# Altium schematic sheet Top.SchDoc
size A4
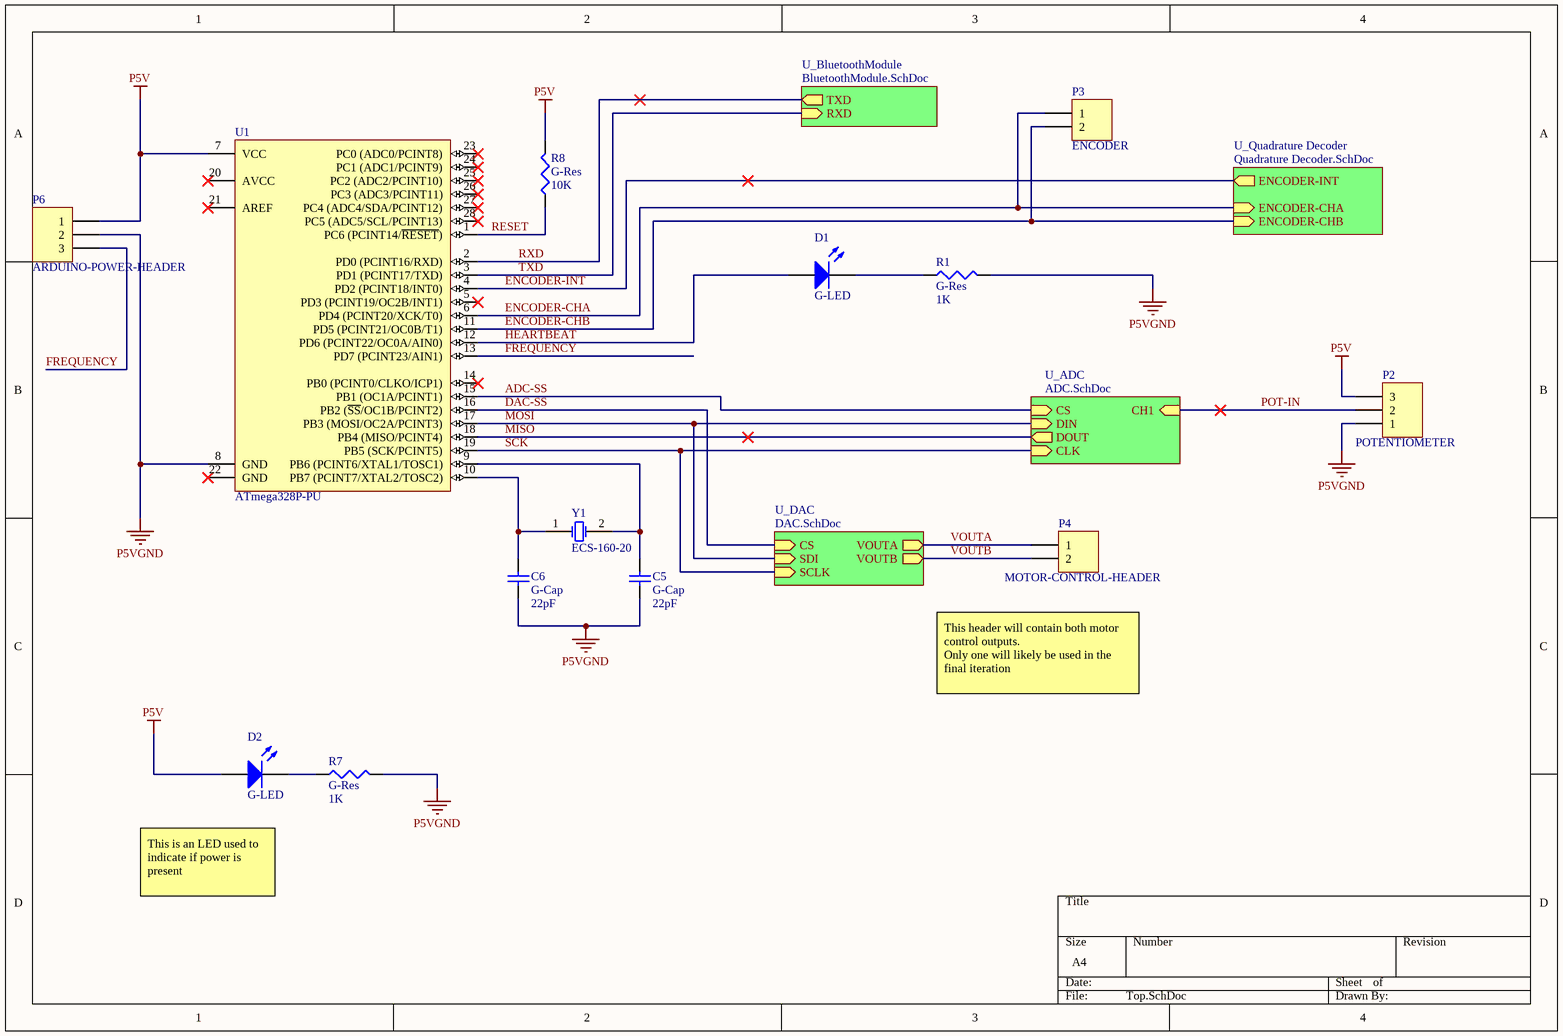
[diagram p0: Top.SchDoc]

## Parts
C5  G-Cap  value 22pF  [Cap2.54mm_LGE1.0]
C6  G-Cap  value 22pF  [Cap2.54mm_LGE1.0]
D1  G-LED  [LED_LGE1.0]
D2  G-LED  [LED_LGE1.0]
P2  POTENTIOMETER  [HDR1X3_LGE1.0]
P3  ENCODER  [HDR1X2_LGE1.0]
P4  MOTOR-CONTROL-HEADER  [HDR1X2_LGE1.0]
P6  ARDUINO-POWER-HEADER  [HDR1X3_LGE1.0]
R1  G-Res  value 1K  [Res2.54mm_LGE1.0]
R7  G-Res  value 1K  [Res2.54mm_LGE1.0]
R8  G-Res  value 10K  [Res2.54mm_LGE1.0]
U1  ATmega328P-PU  [ISDIP16_LGE1.0]
Y1  ECS-160-20  [HC-49U]

## Sub-sheets
U_ADC = ADC.SchDoc: CLK (in), DOUT (out), DIN (in), CS (in), CH1 (in)
U_BluetoothModule = BluetoothModule.SchDoc: TXD (out), RXD (in)
U_DAC = DAC.SchDoc: VOUTA (out), VOUTB (out), CS (in), SCLK (in), SDI (in)
U_Quadrature Decoder = Quadrature Decoder.SchDoc: ENCODER-CHA (in), ENCODER-CHB (in), ENCODER-INT (out)

## Nets
P5V: D2.1(A) P2.3 P6.1 R8.2 U1.7(VCC)
P5VGND: C5.1 C6.1 P2.1 P6.2 R1.2 R7.2 U1.8(GND)
ADC-SS: U1.15(PB1_(OC1A/PCINT1)) ; sheet U_ADC/CS
DAC-SS: U1.16(PB2_(~{SS}/OC1B/PCINT2)) ; sheet U_DAC/CS
ENCODER-CHA: P3.1 U1.6(PD4_(PCINT20/XCK/T0)) ; sheet U_Quadrature Decoder/ENCODER-CHA
ENCODER-CHB: P3.2 U1.11(PD5_(PCINT21/OC0B/T1)) ; sheet U_Quadrature Decoder/ENCODER-CHB
ENCODER-INT: U1.4(PD2_(PCINT18/INT0)) ; sheet U_Quadrature Decoder/ENCODER-INT
FREQUENCY: P6.3 U1.13(PD7_(PCINT23/AIN1))
HEARTBEAT: D1.1(A) U1.12(PD6_(PCINT22/OC0A/AIN0))
MISO: U1.18(PB4_(MISO/PCINT4)) ; sheet U_ADC/DOUT
MOSI: U1.17(PB3_(MOSI/OC2A/PCINT3)) ; sheet U_ADC/DIN, sheet U_DAC/SDI
POT-IN: P2.2 ; sheet U_ADC/CH1
RESET: R8.1 U1.1(PC6_(PCINT14/~{RESET}))
RXD: U1.2(PD0_(PCINT16/RXD)) ; sheet U_BluetoothModule/TXD
SCK: U1.19(PB5_(SCK/PCINT5)) ; sheet U_ADC/CLK, sheet U_DAC/SCLK
TXD: U1.3(PD1_(PCINT17/TXD)) ; sheet U_BluetoothModule/RXD
VOUTA: P4.1 ; sheet U_DAC/VOUTA
VOUTB: P4.2 ; sheet U_DAC/VOUTB
NetC5_2: C5.2 U1.9(PB6_(PCINT6/XTAL1/TOSC1)) Y1.2(OSC2)
NetC6_2: C6.2 U1.10(PB7_(PCINT7/XTAL2/TOSC2)) Y1.1(OSC1)
NetD1_2: D1.2(K) R1.1
NetD2_2: D2.2(K) R7.1

Not connected (* = marked no-connect by the designer): U1 5(PD3_(PCINT19/OC2B/INT1))* 14(PB0_(PCINT0/CLKO/ICP1))* 20(AVCC)* 21(AREF)* 22(GND)* 23(PC0_(ADC0/PCINT8))* 24(PC1_(ADC1/PCINT9))* 25(PC2_(ADC2/PCINT10))* 26(PC3_(ADC3/PCINT11))* 27(PC4_(ADC4/SDA/PCINT12))* 28(PC5_(ADC5/SCL/PCINT13))*

## Notes on the sheet
- This header will contain both motor control outputs.
  Only one will likely be used in the final iteration
- This is an LED used to indicate if power is present

## Library data of the parts
C5 C6 = G-Cap: capacitor (specify value); Published: 8-Jun-2000; LatestRevisionDate: 17-Jul-2002; LatestRevisionNote: Re-released for DXP Platform.; PackageReference: RAD-0.3; Publisher: Altium Limited
D1 D2 = G-LED: Typical RED, GREEN, YELLOW, AMBER GaAs LED; Published: 8-Jun-2000; LatestRevisionDate: 17-Jul-2002; LatestRevisionNote: Re-released for DXP Platform.; PackageVersion: Feb-2002; PackageReference: 3.2X1.6X1.1; Publisher: Altium Limited
P2 P6 = C-Hdr1x3: Header, 4-Pin; LatestRevisionDate: 17-Jul-2002; LatestRevisionNote: Re-released for DXP Platform.; Publisher: Altium Limited
P3 P4 = C-Hdr1x2: Header, 2-Pin; LatestRevisionDate: 17-Jul-2002; LatestRevisionNote: Re-released for DXP Platform.; Publisher: Altium Limited
R1 R7 R8 = G-Res: resistor (specify value); Published: 8-Jun-2000; LatestRevisionDate: 29-May-2009; LatestRevisionNote: IPC-7351 Footprint Added.; PackageReference: J1-0603; Publisher: Altium Limited; PackageDescription: Chip Resistor
U1 = ATmega328P-PU: 8-bit AVR Microcontroller, 32KB Flash, 1KB EEPROM, 2KB SRAM, 28-pin PDIP, Industrial Grade (-40°C to 85°C); Published: 1-Apr-2010; DatasheetVersion: revA, Jan-2010; PackageVersion: revB, Sep-2001; PackageReference: 28P3; Publisher: Altium Limited; PackageDescription: 28-lead (0.300"/7.62mm Wide) Plastic Dual Inline Package (PDIP); Supplier 1: Digi-Key; Supplier Part Number 1: ATMEGA328P-PU-ND; Supplier 2: Farnell; Supplier Part Number 2: 1715487; Supplier 3: Mouser; Supplier Part Number 3: 556-ATMEGA328P-PU; ComponentLink1Description: Manufacturer Link; ComponentLink1URL: http://www.atmel.com/products/avr/default.asp?; ComponentLink2Description: ATmega48A/48PA/88A/88PA/168A/168PA/328/328P Datasheet; ComponentLink2URL: http://www.atmel.com/dyn/resources/prod_documents/8271.pdf; ComponentLink3Description: ATmega48A/48PA/88A/88PA/168A/168PA/328/328P Summary; ComponentLink3URL: http://www.atmel.com/dyn/resources/prod_documents/8271S.pdf; ComponentLink4Description: Atmel.com Home; ComponentLink4URL: http://www.atmel.com
Y1 = ECS-200-20-1: Crystal Oscillator; Published: 17-Jul-2002; DatasheetDocument: 18-Apr-2000; PackageReference: HC-49U; Publisher: Altium Limited; ComponentLink1Description: Manufacturer Link; ComponentLink1URL: http://www.ecsxtal.com/; ComponentLink2Description: Datasheet; ComponentLink2URL: http://www.ecsxtal.com/pdf2/HC49U.PDF